# EAGLE design tx_board (EAGLE 9.6.2)
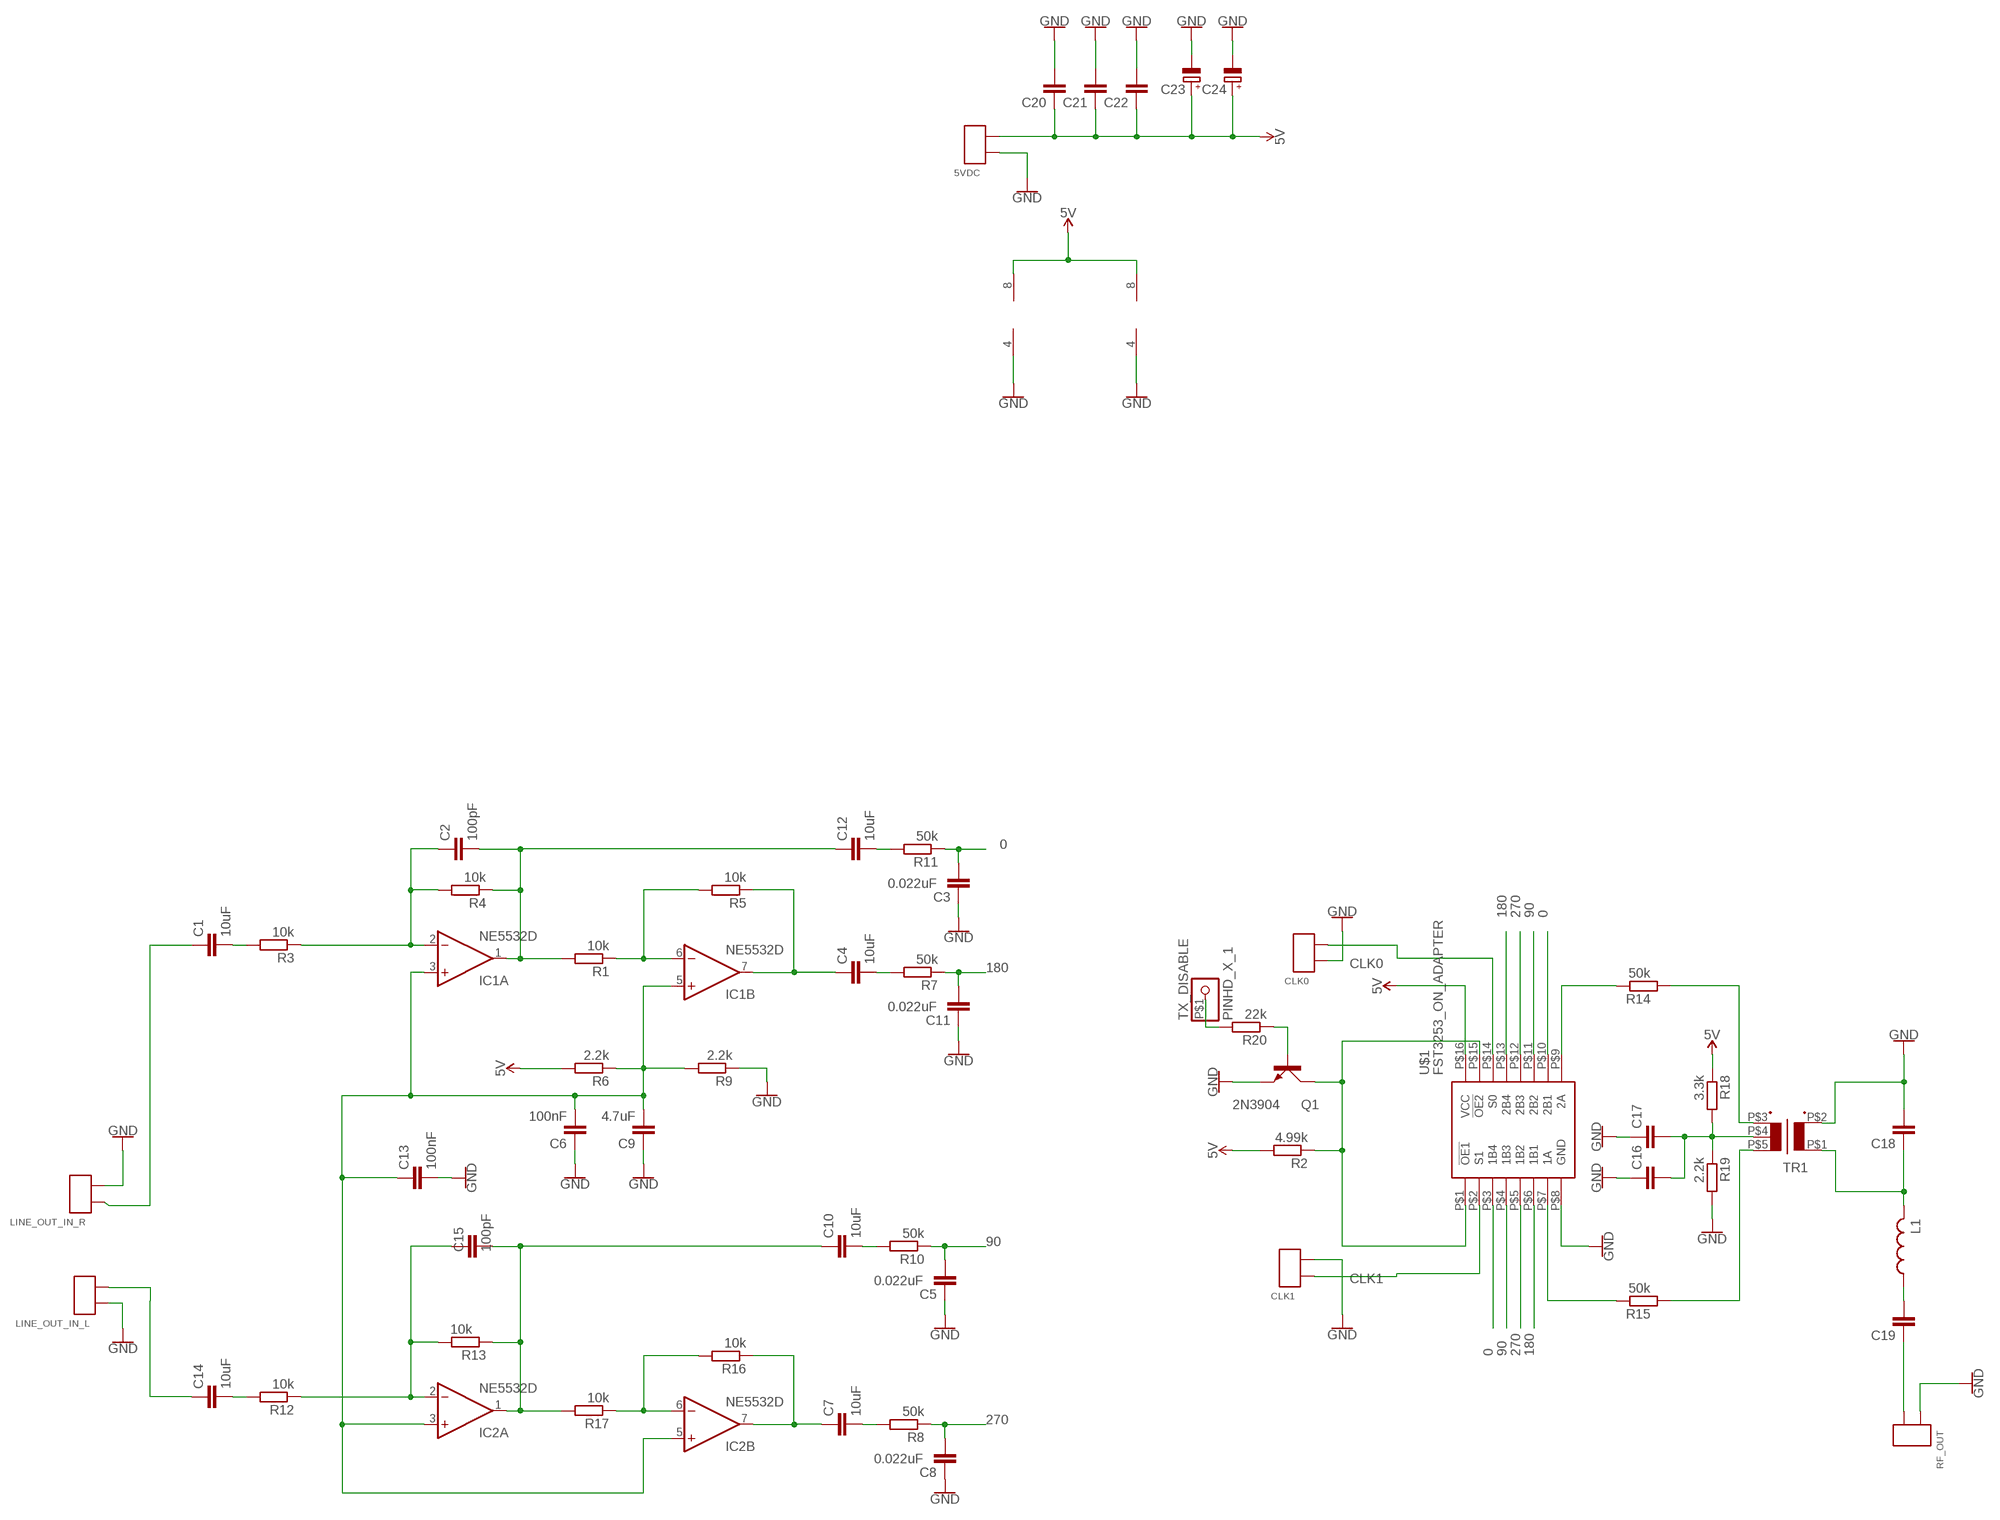
[diagram p0: schematic, sheet 1]

## Parts
5VDC  2X_SMD_PTH_PIN  [2X_SMD_PTH]
C1  10uF  C_0805_PTH  [C0805K]
C2  100pF  C_0805_PTH  [C0805K]
C3  0.022uF  C_0805_SMD  [C0805]
C4  10uF  C_0805_PTH  [C0805K]
C5  0.022uF  C_0805_SMD  [C0805]
C6  100nF  C_0805_SMD  [C0805]
C7  10uF  C_0805_PTH  [C0805K]
C8  0.022uF  C_0805_SMD  [C0805]
C9  4.7uF  C_0805_SMD  [C0805]
C10  10uF  C_0805_PTH  [C0805K]
C11  0.022uF  C_0805_SMD  [C0805]
C12  10uF  C_0805_PTH  [C0805K]
C13  100nF  C_0805_SMD  [C0805]
C14  10uF  C_0805_PTH  [C0805K]
C15  100pF  C_0805_PTH  [C0805K]
C16  C_0805_SMD  [C0805]
C17  C_0805_PTH  [C0805K]
C18  C_0805_PTH  [C0805K]
C19  C_0805_PTH  [C0805K]
C20  C_0805_SMD  [C0805]
C21  C_0805_SMD  [C0805]
C22  C_0805_SMD  [C0805]
C23  C_POL  [E5-5]
C24  C_POL  [E5-5]
CLK0  2X_SMD_PTH_PIN  [2X_SMD_PTH]
CLK1  2X_SMD_PTH_PIN  [2X_SMD_PTH]
IC1  NE5532D  [SO08]
IC2  NE5532D  [SO08]
L1  L_0805_PTH  [M0805]
LINE_OUT_IN_L  2X_SMD_PTH_PIN  [2X_SMD_PTH]
LINE_OUT_IN_R  2X_SMD_PTH_PIN  [2X_SMD_PTH]
Q1  2N3904  [TO92D]
R1  10k  R_0805_PTH  [R0805]
R2  4.99k  R_0805_SMD  [R0805W]
R3  10k  R_0805_PTH  [R0805]
R4  10k  R_0805_PTH  [R0805]
R5  10k  R_0805_SMD  [R0805W]
R6  2.2k  R-EU_0204/7  [0204/7]
R7  50k  R_0805_PTH  [R0805]
R8  50k  R_0805_PTH  [R0805]
R9  2.2k  R_0805_SMD  [R0805W]
R10  50k  R_0805_PTH  [R0805]
R11  50k  R_0805_PTH  [R0805]
R12  10k  R_0805_PTH  [R0805]
R13  10k  R_0805_PTH  [R0805]
R14  50k  R_0805_PTH  [R0805]
R15  50k  R_0805_PTH  [R0805]
R16  10k  R_0805_PTH  [R0805]
R17  10k  R_0805_SMD  [R0805W]
R18  3.3k  R_0805_SMD  [R0805W]
R19  2.2k  R_0805_SMD  [R0805W]
R20  22k  R_0805_SMD  [R0805W]
RF_OUT  2X_SMD_PTH_PIN  [2X_SMD_PTH]
TR1  5PIN_TRANSFORMER  [5PIN_TRANSFORMER]
TX_DISABLE  PINHD_X_1  [PINHD1]
U$1  FST3253_ON_ADAPTER  [SSOP16_ADAPTER]

## Nets
0: C3.2 R11.1 R11.P$1 U$1.P$3(1B4) U$1.P$10(2B1)
5V: 5VDC.P$2(PIN1) 5VDC.T$2(PIN1) C20.1 C21.1 C22.1 C23.+ C24.+ IC1.8(P:V+) IC2.8(P:V+) R2.2 R6.2 R18.1 U$1.P$16(VCC)
90: C5.2 R10.1 R10.P$1 U$1.P$4(1B3) U$1.P$11(2B2)
180: C11.2 R7.1 R7.P$1 U$1.P$6(1B1) U$1.P$13(2B4)
270: C8.2 R8.1 R8.P$1 U$1.P$5(1B2) U$1.P$12(2B3)
CLK0: CLK0.P$2(PIN1) CLK0.T$2(PIN1) U$1.P$14(S0)
CLK1: CLK1.P$1(PIN0) CLK1.T$1(PIN0) U$1.P$2(S1)
GND: 5VDC.P$1(PIN0) 5VDC.T$1(PIN0) C3.1 C5.1 C6.1 C8.1 C9.1 C11.1 C13.2 C16.1 C17.1 C17.P$1 C18.2 C18.P$2 C20.2 C21.2 C22.2 C23.- C24.- CLK0.P$1(PIN0) CLK0.T$1(PIN0) CLK1.P$2(PIN1) CLK1.T$2(PIN1) IC1.4(P:V-) IC2.4(P:V-) LINE_OUT_IN_L.P$1(PIN0) LINE_OUT_IN_L.T$1(PIN0) LINE_OUT_IN_R.P$2(PIN1) LINE_OUT_IN_R.T$2(PIN1) Q1.E R9.1 R19.2 RF_OUT.P$1(PIN0) RF_OUT.T$1(PIN0) TR1.P$2 U$1.P$8(GND)
N$1: Q1.C R2.1 U$1.P$1(!OE1) U$1.P$15(!OE2)
N$2: R15.2 R15.P$2 U$1.P$7(1A)
N$3: R14.2 R14.P$2 U$1.P$9(2A)
N$4: R14.1 R14.P$1 TR1.P$3
N$5: R15.1 R15.P$1 TR1.P$5
N$6: C16.2 C17.2 C17.P$2 R18.2 R19.1 TR1.P$4
N$7: C2.1 C2.P$1 IC1.2(A:-IN) R3.1 R3.P$1 R4.2 R4.P$2
N$8: C18.1 C18.P$1 L1.2 L1.P$2 TR1.P$1
N$9: C19.2 C19.P$2 L1.1 L1.P$1
N$10: C2.2 C2.P$2 C12.1 C12.P$1 IC1.1(A:OUT) R1.2 R1.P$2 R4.1 R4.P$1
N$11: IC1.6(B:-IN) R1.1 R1.P$1 R5.2
N$12: C15.1 C15.P$1 IC2.2(A:-IN) R12.1 R12.P$1 R13.2 R13.P$2
N$13: C10.1 C10.P$1 C15.2 C15.P$2 IC2.1(A:OUT) R13.1 R13.P$1 R17.2
N$14: IC2.6(B:-IN) R16.2 R16.P$2 R17.1
N$15: C4.1 C4.P$1 IC1.7(B:OUT) R5.1
N$16: C7.1 C7.P$1 IC2.7(B:OUT) R16.1 R16.P$1
N$17: C4.2 C4.P$2 R7.2 R7.P$2
N$18: C19.1 C19.P$1 RF_OUT.P$2(PIN1) RF_OUT.T$2(PIN1)
N$19: C1.1 C1.P$1 LINE_OUT_IN_R.P$1(PIN0) LINE_OUT_IN_R.T$1(PIN0)
N$20: C14.1 C14.P$1 LINE_OUT_IN_L.P$2(PIN1) LINE_OUT_IN_L.T$2(PIN1)
N$21: Q1.B R20.1
N$22: C14.2 C14.P$2 R12.2 R12.P$2
N$23: C1.2 C1.P$2 R3.2 R3.P$2
N$24: R20.2 TX_DISABLE.P$1
N$25: C12.2 C12.P$2 R11.2 R11.P$2
N$26: C10.2 C10.P$2 R10.2 R10.P$2
N$27: C7.2 C7.P$2 R8.2 R8.P$2
N$29: C6.2 C9.2 C13.1 IC1.3(A:+IN) IC1.5(B:+IN) IC2.3(A:+IN) IC2.5(B:+IN) R6.1 R9.2

## Library data of the parts
5VDC CLK0 CLK1 LINE_OUT_IN_L LINE_OUT_IN_R RF_OUT = mylib:2X_SMD_PTH_PIN
C1 C2 C4 C7 C10 C12 C14 C15 C17-C19 = mylib:C_0805_PTH
C3 C5 C6 C8 C9 C11 C13 C16 C20-C22 = mylib:C_0805_SMD
C23 C24 = mylib:C_POL
IC1 IC2 = linear:NE5532: AUDIO AMPLIFIER
L1 = mylib:L_0805_PTH
Q1 = transistor-small-signal:2N3904: NPN TRANSISTOR
R1 R3 R4 R7 R8 R10-R16 = mylib:R_0805_PTH
R2 R5 R9 R17-R20 = mylib:R_0805_SMD
R6 = rcl:R-EU_: RESISTOR, European symbol; SPICEPREFIX: R
TR1 = mylib:5PIN_TRANSFORMER
TX_DISABLE = mylib:PINHD_X_1
U$1 = mylib:FST3253_ON_ADAPTER

## Board
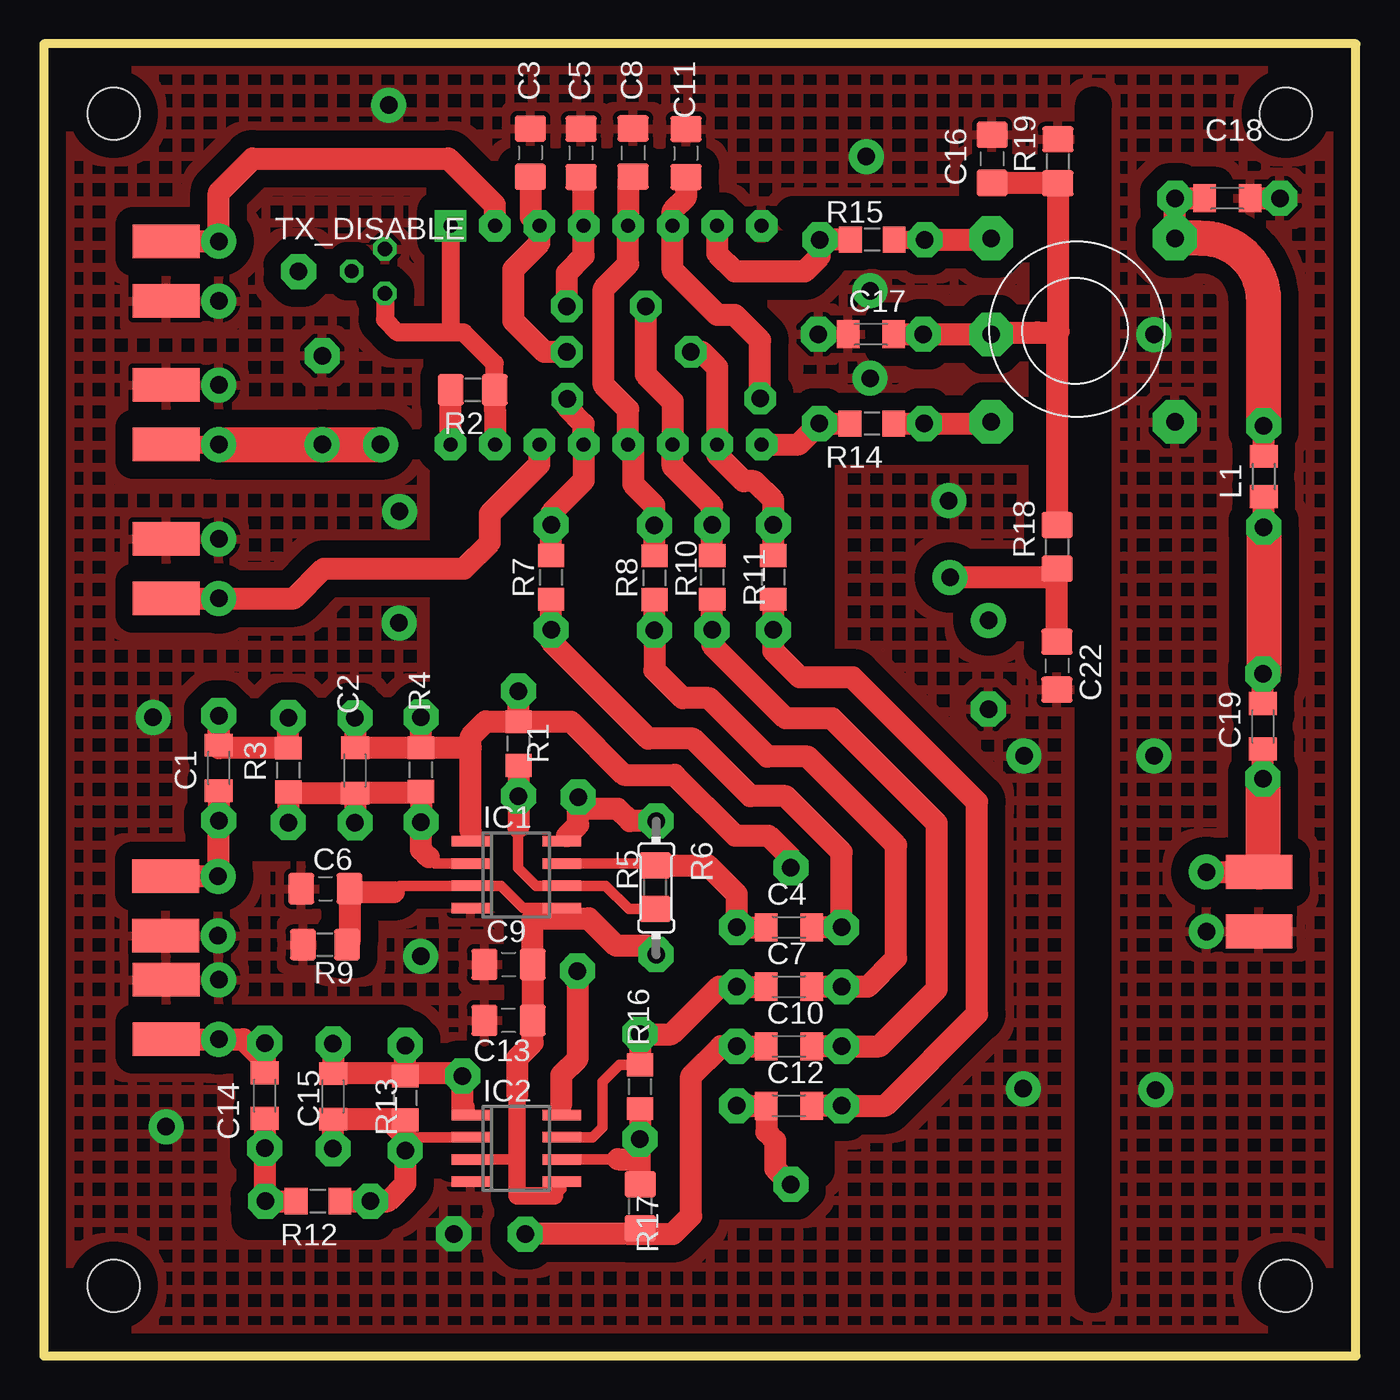
[diagram p1: board, top side]
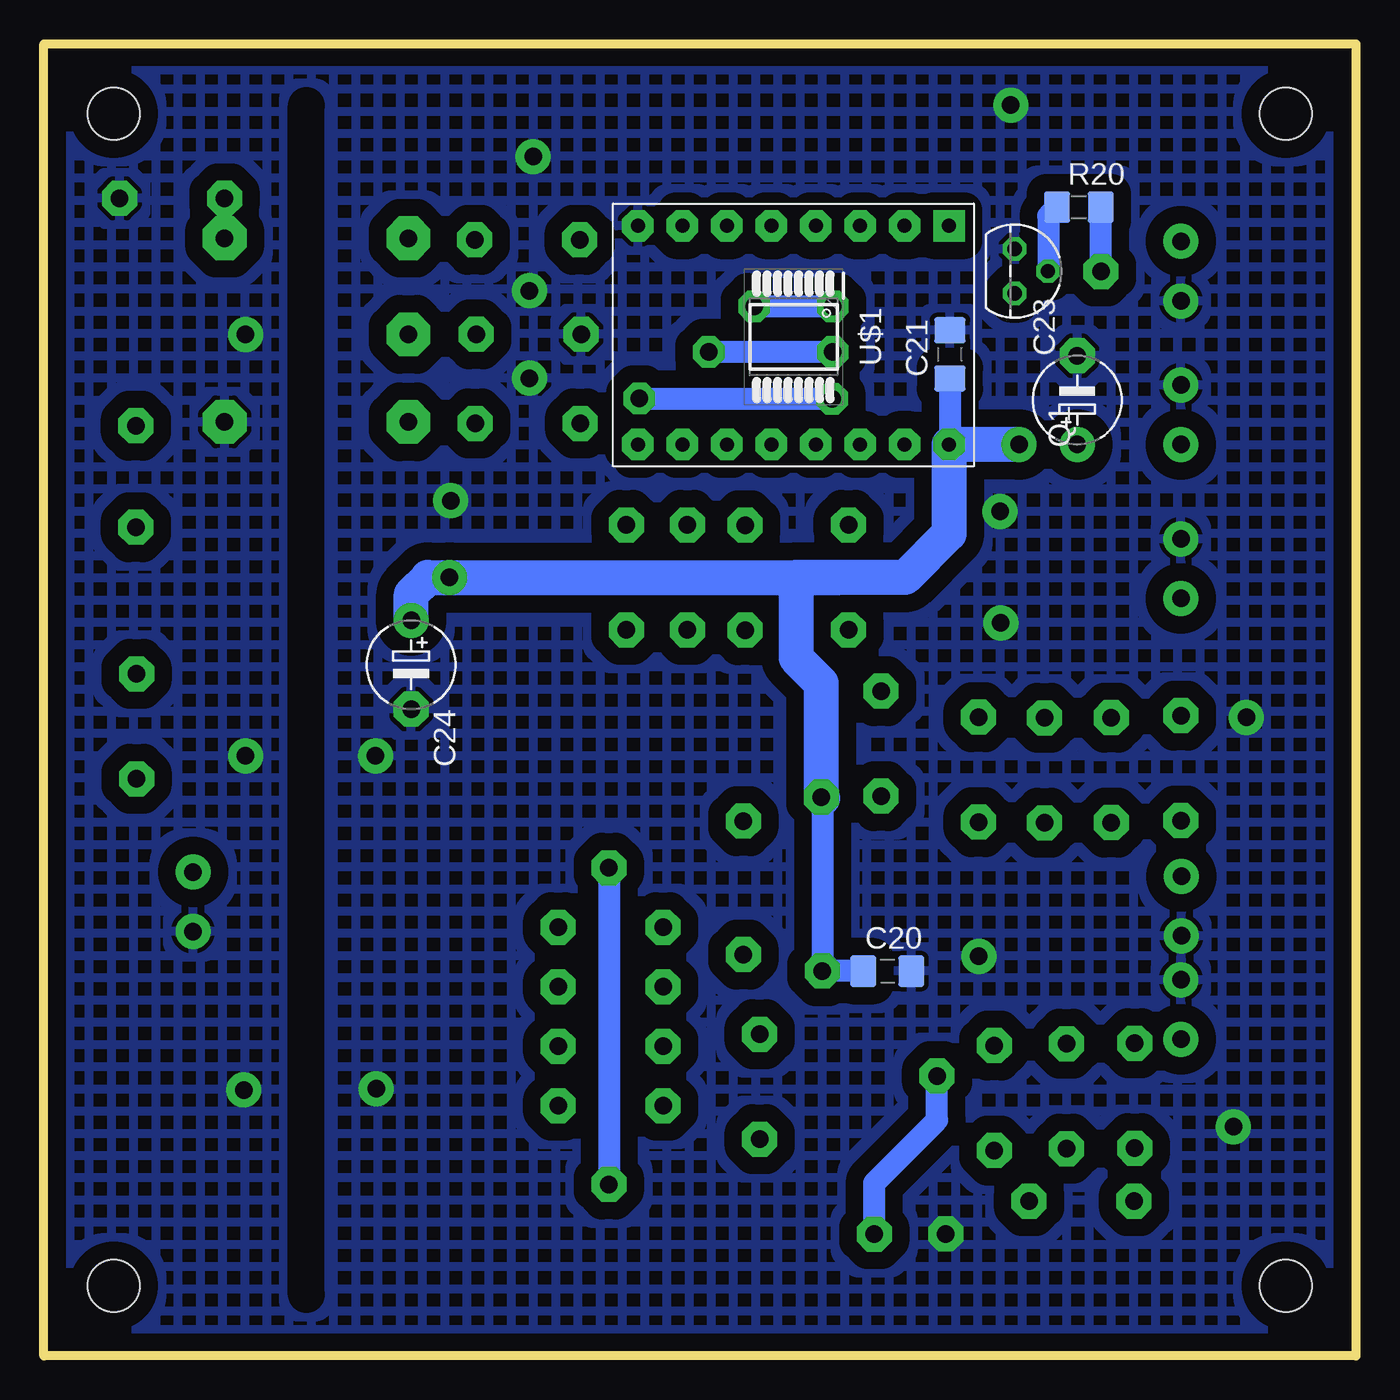
[diagram p2: board, bottom side, seen from below]

Size 75 x 75 mm. Coordinates in mm from the lower left corner, seen from the top.
Outline: 0,0 75,0 75,75 0,75 0,0
Copper layers (1*16): Top 0.035mm / dielectric 1.5mm / Bottom 0.035mm
Design rules "default": minimum track width 6mil, minimum drill 0.35mm, track to track 6mil, track to pad 6mil, pad to pad 6mil, via to via 6mil, smd to smd 6mil, copper to edge 40mil, drill to drill 6mil, minimum pad ring 10mil, minimum via ring 8mil, stop-mask expansion 4mil, vias tented up to drill 0mil, thermal gap 10mil
Holes 3 mm at 4,4 4,71 71,4 71,71
tRestrict: 11 lines
bRestrict: 1 lines

### Footprints (pad centres in the part's own frame; a part is rotated, then mirrored left to right if it is on the bottom)
2X_SMD_PTH = smd 3.81 x 1.93: P$1 0,1.7; P$2 0,-1.7 | drill 1 pad 2: T$1 3,1.7; T$2 3,-1.7
C0805K = smd 1.3 x 1.6: 1 -1.3,0; 2 1.3,0 | drill 1 pad 2 octagon: P$1 -3,0; P$2 3,0
C0805 = smd 1.5 x 1.8: 1 -1.377,0; 2 1.377,0
E5-5 = drill 1 pad 2: + -2.54,0 | drill 1 pad 2 octagon: - 2.54,0
SO08 = smd 0.6 x 2.2: 1 -1.905,-2.6; 2 -0.635,-2.6; 3 0.635,-2.6; 4 1.905,-2.6; 5 1.905,2.6; 6 0.635,2.6; 7 -0.635,2.6; 8 -1.905,2.6
M0805 = smd 1.3 x 1.6: 1 -1.15,0; 2 1.15,0 | drill 1 pad 2 octagon: P$1 -2.9,0; P$2 2.9,0
TO92D = drill 0.813 octagon: B 0,1.905; C 1.27,0; E -1.27,0
R0805 = smd 1.3 x 1.5: 1 -1.25,0; 2 1.25,0 | drill 1 pad 2 octagon: P$1 -3,0; P$2 3,0
R0805W = smd 1.5 x 1.8: 1 -1.252,0; 2 1.252,0
0204/7 = drill 1 pad 2 octagon: 1 -3.81,0; 2 3.81,0
5PIN_TRANSFORMER = drill 1 pad 2.5 octagon: P$1 1.5,1.5; P$2 1.5,12; P$3 12,12; P$4 12,7; P$5 12,1.5
PINHD1 = drill 1 pad 2 octagon: P$1 0,0
SSOP16_ADAPTER = drill 0.8 pad 1.8 square: P$1 0,0 | drill 0.8 pad 1.8 octagon: P$2 0,-2.54; P$3 0,-5.08; P$4 0,-7.62; P$5 0,-10.16; P$6 0,-12.7; P$7 0,-15.24; P$8 0,-17.78; P$9 12.5,-17.78; P$10 12.5,-15.24; P$11 12.5,-12.7; P$12 12.5,-10.16; P$13 12.5,-7.62; P$14 12.5,-5.08; P$15 12.5,-2.54; P$16 12.5,0

### Placement (x,y rotation side)
5VDC  7,53.8 0 top
C1  10,33.6 90 top
C2  17.79,33.46 90 top
C3  27.82,68.77 270 top
C4  42.6,24.5 0 top
C5  30.71,68.76 270 top
C6  16.1,26.7 0 top
C7  42.6,21.1 0 top
C8  33.69,68.78 270 top
C9  26.57,22.37 0 top
C10  42.6,17.7 0 top
C11  36.71,68.75 270 top
C12  42.6,14.3 0 top
C13  26.57,19.17 180 top
C14  12.64,14.87 270 top
C15  16.53,14.83 90 top
C16  54.21,68.42 270 top
C17  47.28,58.39 0 top
C18  67.66,66.17 0 top
C19  69.69,35.98 90 top
C20  26.78,21.99 0 bottom
C21  23.2,57.24 90 bottom
C22  57.92,39.45 270 top
C23  15.92,54.63 90 bottom
C24  54,39.5 270 bottom
CLK0  7,45 0 top
CLK1  7,62 0 top
IC1  27,27.5 270 top
IC2  27,11.86 270 top
L1  69.74,50.26 90 top
LINE_OUT_IN_L  7,19.8 0 top
LINE_OUT_IN_R  6.97,25.71 0 top
Q1  19.5,62 270 bottom
R1  27.14,35 90 top
R2  24.52,55.22 180 top
R3  13.98,33.48 90 top
R4  21.56,33.51 270 top
R5  34.95,26.79 270 top
R6  35.01,26.75 90 top
R7  29,44.5 270 top
R8  34.91,44.48 270 top
R9  16.08,23.5 0 top
R10  38.21,44.5 270 top
R11  41.7,44.5 270 top
R12  15.68,8.84 180 top
R13  20.67,14.74 270 top
R14  47.34,53.29 180 top
R15  47.36,63.8 180 top
R16  34.08,15.38 270 top
R17  34.1,8.55 270 top
R18  57.93,46.24 90 top
R19  57.97,68.28 90 top
R20  15.83,65.66 0 bottom
RF_OUT  69.47,25.95 180 top
TR1  66.16,65.38 180 top
TX_DISABLE  14.56,61.98 0 top
U$1  23.25,64.6 270 bottom

### Tracks (layer width: path | path; a pad name or v marks a point on that pad's centre or on a via)
0  (via drill 1 pad 1.8)
  Top 1.27: v29.89,57.38 28.62,57.38 26.83,59.17 26.83,60 26.83,62.1 28.33,63.6 U$1.P$3 27.83,65.1 C3.2 | v36.99,57.38 37.62,57.38 38.49,56.51 38.49,53.6 U$1.P$10 38.49,51.51 40,50 40.61,50 41.7,48.91 R11.P$1 R11.1
  Bottom 1.27: v29.89,57.38 v36.99,57.38
5V  (via drill 1 pad 2)
  Top 0.61: IC1.8 29.9,29.7 | 29.58,14.41 29.58,13.79 IC2.8
  Top 1.016: 5VDC.P$2 5VDC.T$2
  Top 1.27: R6.2 33.51,30.56 32.8,31.27 31.22,31.27 v30.55,31.94 30.55,30.36 29.9,29.7 | v51.81,44.5 57.44,44.5 R18.1 57.92,44.98 C22.1 | v30.5,22 30.5,16.95 29.58,16.03 29.58,14.41 | U$1.P$16 23.25,55.2 R2.2
  Top 2: 5VDC.T$2 C23.+ v19.24,52.09 v19.25,52.1
  Bottom 1.27: 30.48,31.87 30.48,22.02 | C21.1 23.2,52.15 U$1.P$16 | C20.1 v30.5,21.99 v30.5,22 | v19.25,52.1 v19.24,52.09 v19.25,52.1
  Bottom 2: v19.25,52.1 U$1.P$16 23.25,47 25.75,44.5 28.5,44.5 | 28.5,44.5 32,44.5 32,39.89 30.55,38.44 v30.55,31.94 30.48,31.87 | 28.5,44.5 29.5,44.5 v51.81,44.5 53.04,44.5 54,43.54 C24.+ | 30.48,22.02 v30.5,22
90  (via drill 1 pad 1.8)
  Top 1.27: C5.2 30.87,67.22 U$1.P$4 30.87,62.87 29.9,61.9 v29.9,60 | v34.4,60 34.4,56.1 35.95,54.55 U$1.P$11 35.95,50.85 38.21,48.59 R10.P$1 R10.1
  Bottom 1.27: v34.4,60 v29.9,60
180  (via drill 1 pad 1.8)
  Top 1.27: C11.2 36.71,66.21 35.95,65.45 U$1.P$6 35.95,62.05 38.5,59.5 39.5,59.5 40.95,58.05 v40.95,54.72 | v29.93,54.71 29.93,54.21 30.87,53.27 U$1.P$13 30.87,50.03 29,48.16 R7.P$1 R7.1
  Bottom 1.27: v40.95,54.72 v40.94,54.71 v29.93,54.71
270
  Top 1.27: C8.2 33.41,67.12 U$1.P$5 33.41,62.41 32,61 32,55.5 33.41,54.09 U$1.P$12 33.69,51.82 33.69,49.83 34.91,48.61 R8.P$1 R8.1
CLK0
  Top 1.27: CLK0.P$2 CLK0.T$2 14.3,43.3 16,45 24,45 25.5,46.5 25.5,48.14 28.33,50.97 U$1.P$14
CLK1
  Top 1.27: U$1.P$2 25.79,65.78 23.13,68.44 11.94,68.44 10,66.5 CLK1.T$1 CLK1.P$1
GND  (via drill 1 pad 2)
  Top 1.27: C18.2 C18.P$2
  other vias: 19.72,71.49 20.33,48.26 6.25,36.5 63.47,34.3 56.04,34.3 63.56,15.2 6.99,13.1 47.23,55.88 47.23,60.88 63.46,58.38 23.43,6.96 20.3,41.9 55.99,15.26 47.02,68.55 21.55,22.83 51.73,48.88
  pour Top (isolate 1, hatched): 77.5,-2.5 -2.5,-2.5 -2.5,77.5 77.5,77.5
  pour Bottom (isolate 1, hatched): 76.5,-1.5 -1.5,-1.5 -1.5,76.5 76.5,76.5
N$1
  Top 1.016: R2.1 25.77,56.73 24,58.5 23,58.5 | 23,58.5 20.23,58.5 19.5,59.23 Q1.C | U$1.P$1 23.25,58.75 23,58.5
  Top 1.27: R2.1 25.77,54.12 25.79,54.1 U$1.P$15
N$2
  Top 1.27: R15.2 R15.P$2 44.36,62.86 43.5,62 39.5,62 38.49,63.01 U$1.P$7
N$3
  Top 1.27: U$1.P$9 43.15,52.1 R14.P$2 R14.2
N$4
  Top 1.27: R14.1 R14.P$1 54.07,53.29 TR1.P$3
N$5
  Top 1.016: R15.1 R15.P$1
  Top 1.27: TR1.P$5 54.08,63.8 R15.P$1
N$6
  Top 1.27: R18.2 57.93,58.5 56.79,58.5 | 56.79,58.5 54.28,58.5 TR1.P$4 C17.P$2 C17.2 | 56.79,58.5 56.8,58.5 57.94,58.5 58,58.56 58,67 R19.1 54.23,67.03 C16.2
N$7
  Top 0.61: 22,28.5 22.36,28.14 IC1.2
  Top 1.27: R3.P$1 R3.1 14.06,32.15 C2.1 | C2.1 21.46,32.16 R4.2 R4.P$2 21.56,28.94 22,28.5 | C2.1 C2.P$1
N$8
  Top 1.27: L1.2 L1.P$2 | TR1.P$1 C18.P$1 C18.1
  Top 2: L1.P$2 69.74,60.3 arc90 66.16,63.88 TR1.P$1
N$9
  Top 1.27: L1.P$1 L1.1 | C19.2 C19.P$2
  Top 2: L1.P$1 69.74,39.03 arc-90 C19.P$2
N$10  (via drill 1 pad 2)
  Top 0.61: IC1.1 24.4,29.95
  Top 1.27: R4.1 C2.2 C2.P$2 | R4.1 R4.P$1 | R4.1 24.4,34.76 | R1.2 25.26,36.26 24.4,35.4 24.4,34.76 | R1.2 R1.P$2 | 24.4,29.95 24.4,34.76 | R1.2 30.14,36.25 33.18,33.21 36.06,33.21 39.54,29.73 41.42,29.73 42.7,28.45 v42.7,27.9 | C12.P$1 C12.1 41.3,12.8 41.8,12.3 41.8,10.7 v42.7,9.8
  Bottom 1.27: v42.7,27.9 v42.7,9.8
N$11
  Top 0.61: R5.2 33.45,25.54 32.12,26.86 IC1.6 28.14,26.86 27.1,27.9 27.1,30.19 27.12,30.21
  Top 1.27: R1.1 R1.P$1 27.14,30.23 27.12,30.21
N$12
  Top 0.61: 23.91,12.5 23.91,12.49 IC2.2 20.21,12.49 19.22,13.49 R13.2
  Top 1.27: R12.1 R12.P$1 19.68,8.84 20.67,9.83 R13.P$2 R13.2 20.63,13.53 C15.1 C15.P$1
N$13  (via drill 1 pad 2)
  Top 0.61: IC2.1 24,14.16 24,14.18
  Top 1.27: 20.82,16.14 R13.1 | R13.1 R13.P$1 | R13.1 20.53,16.13 C15.2 C15.P$2 | 27.55,6.98 v27.52,6.95 27.54,6.97 33.43,6.97 33.44,6.96 34.15,6.96 | C10.1 C10.P$1 38.7,17.7 37,16 37,8 35.96,6.96 34.15,6.96 | 20.82,16.14 R13.1 | 20.82,16.14 23.8,16.14 v23.94,16 23.94,14.12 24,14.18 | R17.2 34.15,7.25 34.15,6.96
  Bottom 1.27: v27.52,6.95 27.52,9.88 23.94,13.46 v23.94,16
N$14
  Top 0.61: IC2.6 32.81,11.22 32.82,11.23
  Top 1.27: R16.2 R16.P$2 34.08,11 | R17.1 34.08,9.82 34.08,11 | 32.82,11.23 33.85,11.23 34.08,11
N$15
  Top 0.61: R5.1 34.86,28.14 IC1.7
  Top 1.27: R5.1 37.96,28.04 39.6,26.4 C4.P$1 C4.1
N$16
  Top 0.61: IC2.7 31.38,12.49 31.94,13.06 31.94,15.66 32.91,16.63 R16.1 33.9,16.81
  Top 1.27: R16.1 R16.P$1 35.88,18.38 38.6,21.1 C7.P$1 C7.1
N$17
  Top 1.27: C4.2 C4.P$2 45.6,28.8 42.4,32 40.39,32 37.11,35.28 34.55,35.28 29,40.83 R7.P$2 R7.2
N$18
  Top 1.27: RF_OUT.T$2 RF_OUT.P$2 | C19.P$1 C19.1
  Top 2: C19.P$1 69.69,27.87 arc-90 RF_OUT.P$2
N$19
  Top 1.27: C1.1 C1.P$1 9.97,30.57 LINE_OUT_IN_R.T$1 LINE_OUT_IN_R.P$1
N$20
  Top 1.27: C14.P$1 C14.1 12.64,16.86 11.4,18.1 LINE_OUT_IN_L.T$2 LINE_OUT_IN_L.P$2
N$21
  Bottom 1.27: R20.1 17.58,65.16 17.58,62.01 Q1.B
N$22
  Top 1.27: C14.2 C14.P$2 12.64,8.88 R12.P$2 R12.2
N$23
  Top 1.27: R3.P$2 R3.2 10,34.73 C1.P$2 C1.2
N$24
  Bottom 1.27: TX_DISABLE.P$1 14.58,62 R20.2
N$25
  Top 1.27: C12.2 C12.P$2 48.11,14.3 53.35,19.54 53.35,31.66 46.23,38.78 43.22,38.78 41.7,40.3 R11.P$2 R11.2
N$26
  Top 1.27: C10.2 C10.P$2 47.78,17.7 51.05,20.97 51.05,30.44 45.06,36.43 42.41,36.43 38.21,40.63 R10.P$2 R10.2
N$27
  Top 1.27: C7.2 C7.P$2 47.1,21.1 48.72,22.72 48.72,29.19 43.66,34.25 41.37,34.25 38.03,37.59 36.52,37.59 34.91,39.2 R8.P$2 R8.2
N$29
  Top 0.508: IC1.5 29.5,25.5
  Top 0.61: 20,26.5 20.36,26.86 IC1.3 26.14,26.86 27.41,25.59 IC1.5 29.6,25.06 29.65,25.01 | IC2.3 26.82,11.22 27.05,11 27.07,10.98 | IC2.5 29.6,9.54 29.21,9.15
  Top 1: 27.07,14.93 27.07,10.98 27.07,9.15 29.21,9.15
  Top 1.27: 27.07,14.93 27.07,17.01 27.95,17.89 C13.1 C9.2 27.95,25.01 29.65,25.01 31.15,25.01 32.72,23.44 34.51,23.44 R6.1 | 20,26.5 17.68,26.5 C6.2 17.48,23.64 R9.2